# EAGLE design shield (EAGLE 7.6.0)
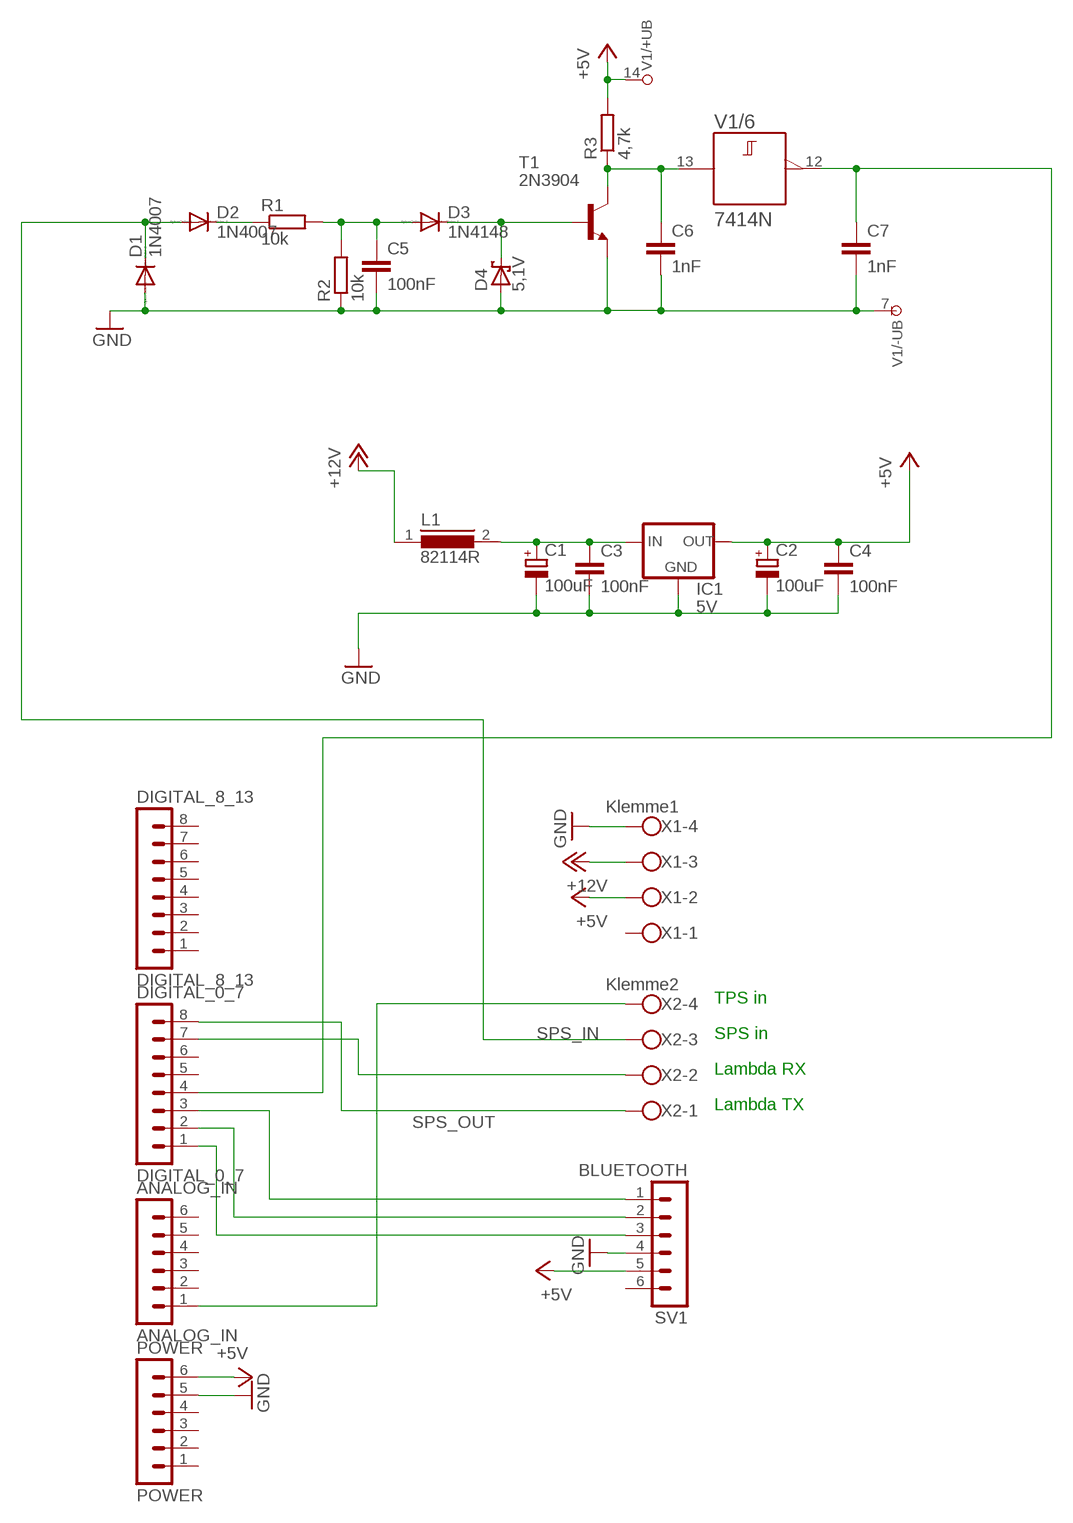
[diagram p0: schematic, sheet 1]

## Parts
ANALOG_IN  ANALOG_IN  MA06-1  [MA06-1]
C1  100uF  CPOL-EUE2-4  [E2-4]
C2  100uF  CPOL-EUE2-4  [E2-4]
C3  100nF  C-EU050-035X075  [C050-035X075]
C4  100nF  C-EU050-035X075  [C050-035X075]
C5  100nF  C-EU075-032X103  [C075-032X103]
C6  1nF  C-EU075-032X103  [C075-032X103]
C7  1nF  C-EU075-032X103  [C075-032X103]
D1  1N4007  DIODE-D-5  [D-5]
D2  1N4007  DIODE-D-5  [D-5]
D3  1N4148  DIODE-D-5  [D-5]
D4  5,1V  SCHOTTKY-DIODEDO35-7  [DO35-7]
DIGITAL_0_7  DIGITAL_0_7  MA08-1  [MA08-1]
DIGITAL_8_13  DIGITAL_8_13  MA08-1  [MA08-1]
IC1  5V  78XXS  [78XXS]
L1  82114R  [82114R]
POWER  POWER  MA06-1  [MA06-1]
R1  10k  R-EU_0204/5  [0204/5]
R2  10k  R-EU_0204/5  [0204/5]
R3  4,7k  R-EU_0204/5  [0204/5]
SV1  BLUETOOTH  MA06-1  [MA06-1]
T1  2N3904  [TO92]
V1  7414N  [DIL14]
X1  Klemme1  W237-4  [W237-4]
X2  Klemme2  W237-4  [W237-4]

## Nets
+5V: C2.+ C4.1 IC1.OUT POWER.6 R3.2 SV1.5 V1.14(/+UB:+UB) X1.2
+12V: L1.1 X1.3
GND: C1.- C2.- C3.2 C4.2 C5.2 C6.2 C7.2 D1.A D4.A IC1.GND POWER.5 R2.1 SV1.4 T1.3(E) V1.7(/-UB:-UB) X1.4
N$1: C1.+ C3.1 IC1.IN L1.2
N$2: DIGITAL_0_7.7 X2.2
N$3: DIGITAL_0_7.8 X2.1
N$4: D2.C R1.1
N$5: C5.1 D3.A R1.2 R2.2
N$6: D3.C D4.C T1.2(B)
N$7: C6.1 R3.1 T1.1(C) V1.13(/6:A)
N$8: ANALOG_IN.1 X2.4
N$9: DIGITAL_0_7.2 SV1.2
N$10: DIGITAL_0_7.1 SV1.3
N$11: DIGITAL_0_7.3 SV1.1
SPS_IN: D1.C D2.A X2.3
SPS_OUT: C7.1 DIGITAL_0_7.4 V1.12(/6:Y)
Unconnected: ANALOG_IN.2 ANALOG_IN.3 ANALOG_IN.4 ANALOG_IN.5 ANALOG_IN.6 DIGITAL_0_7.5 DIGITAL_0_7.6 DIGITAL_8_13.1 DIGITAL_8_13.2 DIGITAL_8_13.3 DIGITAL_8_13.4 DIGITAL_8_13.5 DIGITAL_8_13.6 DIGITAL_8_13.7 DIGITAL_8_13.8 POWER.1 POWER.2 POWER.3 POWER.4 SV1.6 V1.1(/1:A) V1.2(/1:Y) V1.3(/2:A) V1.4(/2:Y) V1.5(/3:A) V1.6(/3:Y) V1.8(/4:Y) V1.9(/4:A) V1.10(/5:Y) V1.11(/5:A) X1.1

## Notes on the sheet
- TPS in
- SPS in
- Lambda RX
- Lambda TX

## Library data of the parts
ANALOG_IN POWER SV1 = con-lstb:MA06-1: PIN HEADER; OC_FARNELL: unknown; OC_NEWARK: unknown
C1 C2 = rcl:CPOL-EU: POLARIZED CAPACITOR, European symbol
C3-C7 = rcl:C-EU: CAPACITOR, European symbol
D1-D3 = diode:DIODE-: DIODE
D4 = diode:SCHOTTKY-DIODE: Schottky Diode
DIGITAL_0_7 DIGITAL_8_13 = con-lstb:MA08-1: PIN HEADER; OC_FARNELL: unknown; OC_NEWARK: unknown
IC1 = v-reg:78XXS: VOLTAGE REGULATOR
L1 = inductors:82114R: INDUCTOR
R1-R3 = rcl:R-EU_: RESISTOR, European symbol
T1 = transistor:2N3904: NPN TRANSISTOR
V1 = 74ttl-din:74*14: Hex schmitt trigger INVERTER
X1 X2 = con-wago-500:W237-4: WAGO SCREW CLAMP; OC_FARNELL: unknown; OC_NEWARK: unknown

## Board
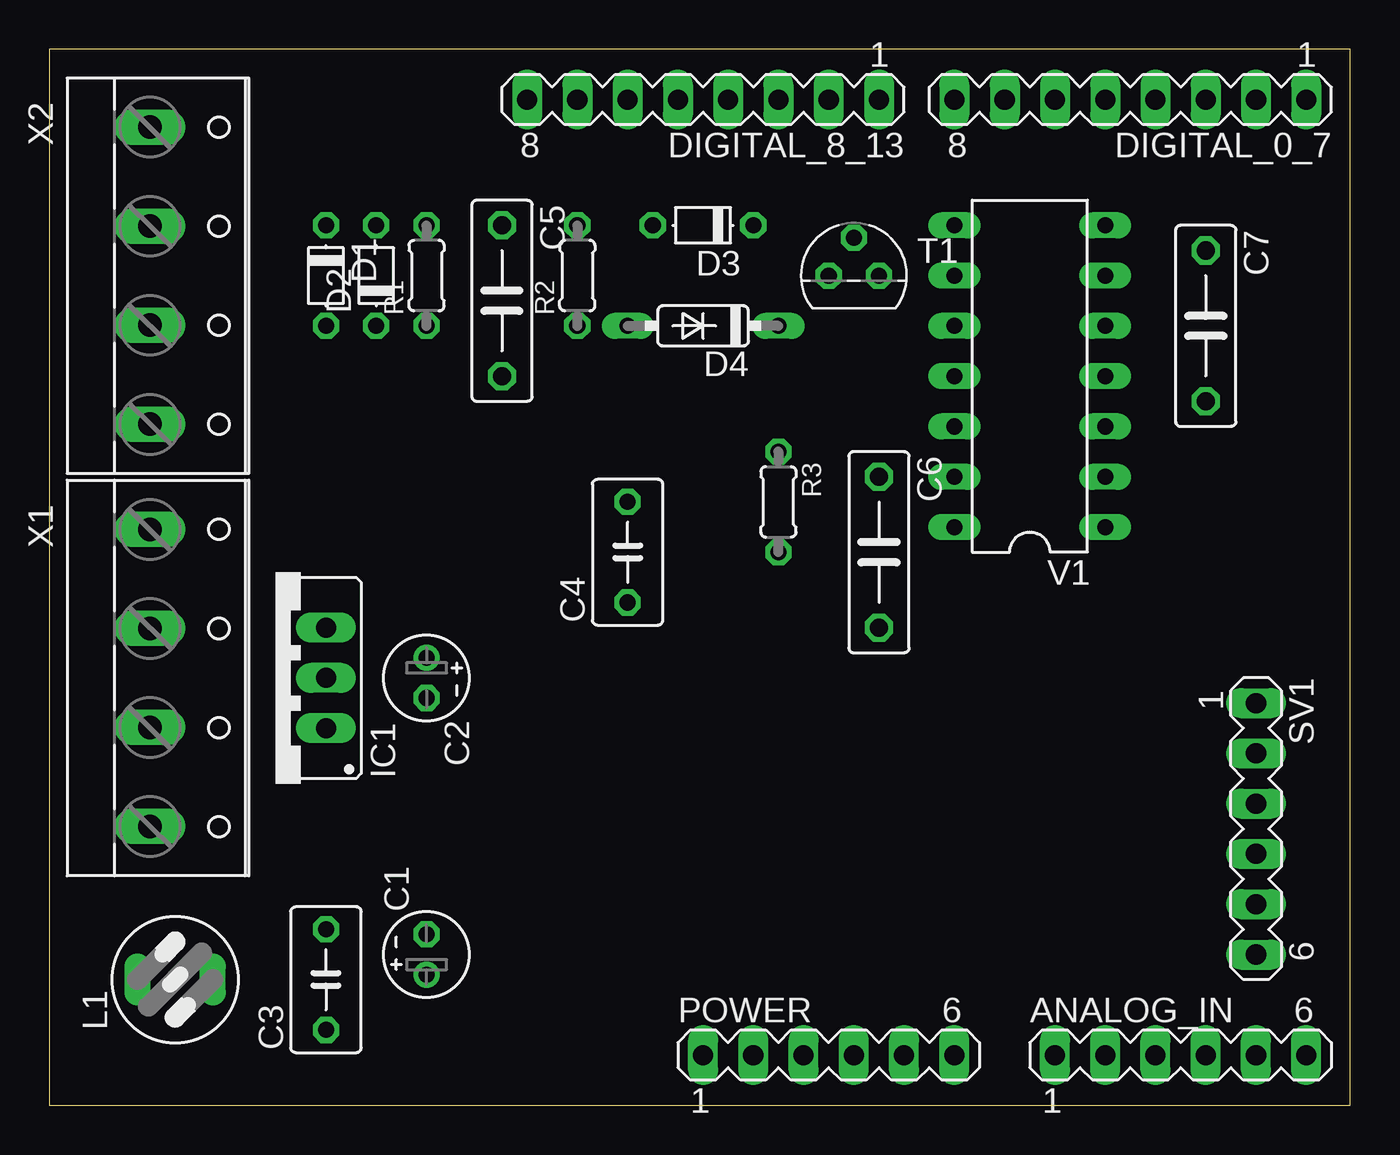
[diagram p1: board, top side]
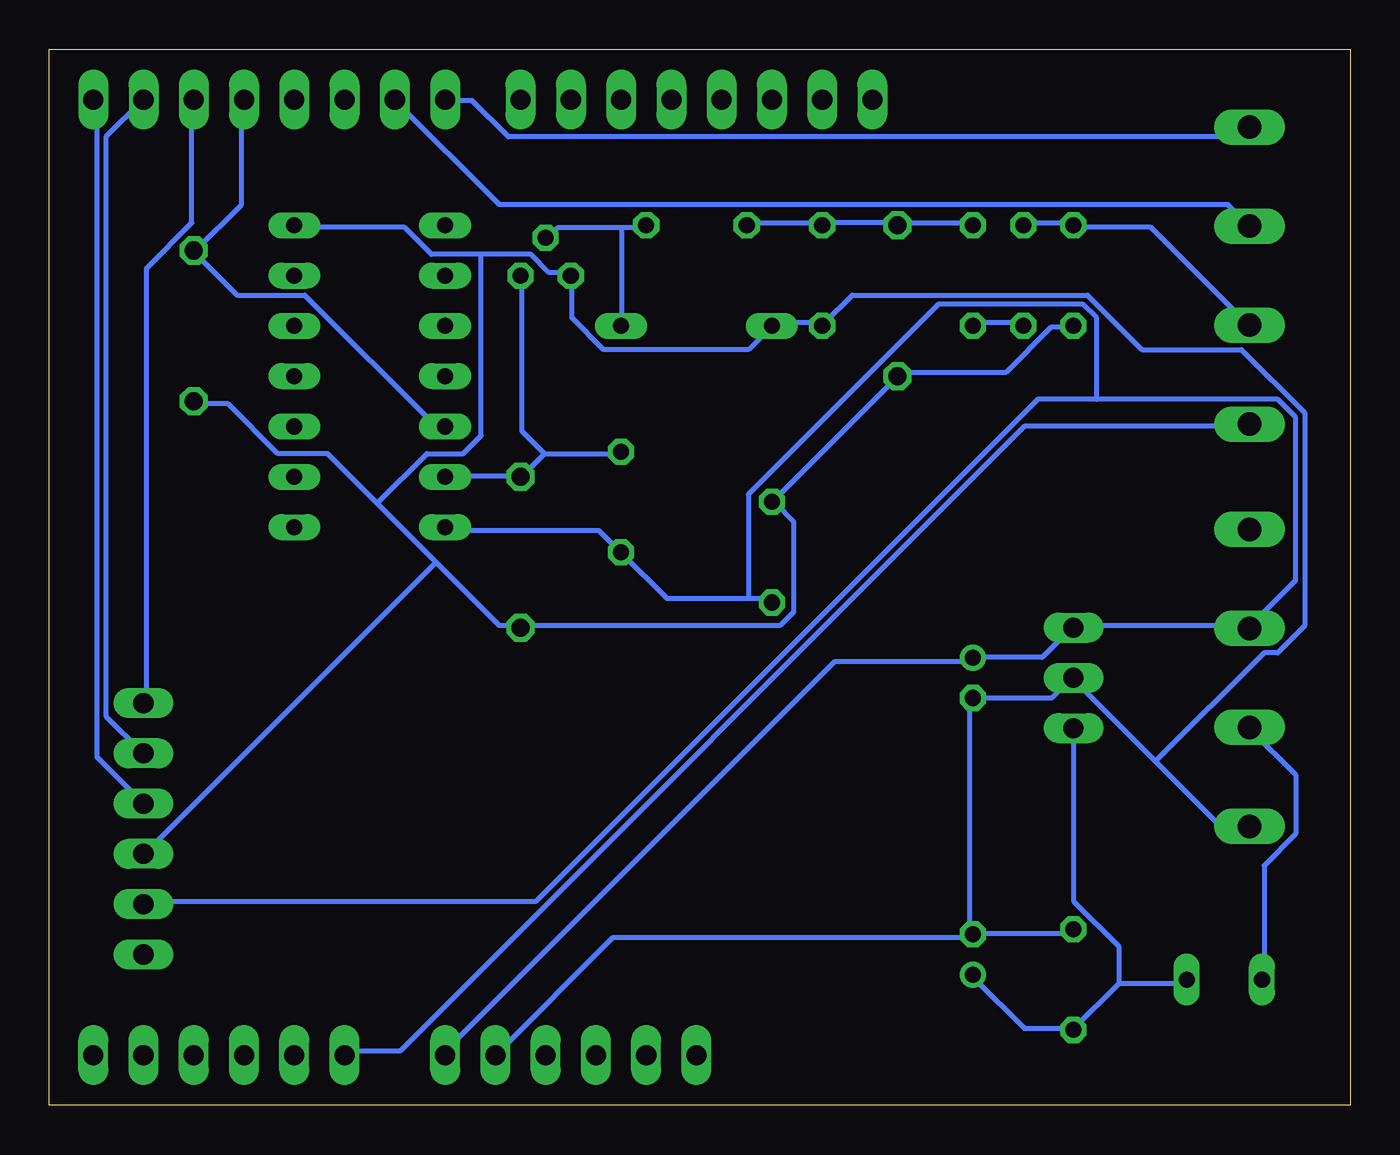
[diagram p2: board, bottom side, seen from below]

Size 65.71 x 53.33 mm. Coordinates in mm from the lower left corner, seen from the top.
Outline: 0,0 65.71,0 65.71,53.33 0,53.33 0,0
Copper layers (1*16): Top 0.035mm / dielectric 1.5mm / Bottom 0.035mm
Design rules "default": minimum track width 10mil, minimum drill 24mil, track to track 8mil, track to pad 8mil, pad to pad 8mil, via to via 8mil, smd to smd 8mil, copper to edge 40mil, drill to drill 8mil, minimum pad ring 10mil, minimum via ring 8mil, stop-mask expansion 4mil, vias tented up to drill 0mil, thermal gap 10mil

### Footprints (pad centres in the part's own frame; a part is rotated, then mirrored left to right if it is on the bottom)
MA06-1 = drill 1.016 long: 1 -6.35,0; 2 -3.81,0; 3 -1.27,0; 4 1.27,0; 5 3.81,0; 6 6.35,0
E2-4 = drill 0.813 pad 1.27: + -1.016,0 | drill 0.813 pad 1.27 octagon: - 1.016,0
C050-035X075 = drill 0.813 octagon: 1 -2.54,0; 2 2.54,0
C075-032X103 = drill 0.914 octagon: 1 -3.81,0; 2 3.81,0
D-5 = drill 0.813 octagon: A 2.54,0; C -2.54,0
DO35-7 = drill 0.813 long: A 3.81,0; C -3.81,0
MA08-1 = drill 1.016 long: 1 -8.89,0; 2 -6.35,0; 3 -3.81,0; 4 -1.27,0; 5 1.27,0; 6 3.81,0; 7 6.35,0; 8 8.89,0
78XXS = drill 1.016 long: GND 0,-2.54; IN -2.54,-2.54; OUT 2.54,-2.54
82114R = drill 0.813 long: 1 0,1.905; 2 0,-1.905
0204/5 = drill 0.813 octagon: 1 -2.54,0; 2 2.54,0
TO92 = drill 0.813 octagon: 1 1.27,0; 2 0,1.905; 3 -1.27,0
DIL14 = drill 0.813 long: 1 -7.62,-3.81; 2 -5.08,-3.81; 3 -2.54,-3.81; 4 0,-3.81; 5 2.54,-3.81; 6 5.08,-3.81; 7 7.62,-3.81; 8 7.62,3.81; 9 5.08,3.81; 10 2.54,3.81; 11 0,3.81; 12 -2.54,3.81; 13 -5.08,3.81; 14 -7.62,3.81
W237-4 = drill 1.194 long: 1 -7.5,-1.27; 2 -2.5,-1.27; 3 2.5,-1.27; 4 7.5,-1.27

### Placement (x,y rotation side)
ANALOG_IN  57.15,2.54 0 top
C1  19.05,7.62 90 top
C2  19.05,21.59 270 top
C3  13.97,6.35 90 top
C4  29.21,27.94 90 top
C5  22.86,40.64 270 top
C6  41.91,27.94 270 top
C7  58.42,39.37 270 top
D1  13.97,41.91 270 top
D2  16.51,41.91 90 top
D3  33.02,44.45 180 top
D4  33.02,39.37 180 top
DIGITAL_0_7  54.61,50.8 180 top
DIGITAL_8_13  33.02,50.8 180 top
IC1  11.43,21.59 90 top
L1  6.35,6.35 90 top
POWER  39.37,2.54 0 top
R1  19.05,41.91 90 top
R2  26.67,41.91 90 top
R3  36.83,30.48 270 top
SV1  60.96,13.97 270 top
T1  40.64,41.91 0 top
V1  49.53,36.83 90 top
X1  6.35,21.59 270 top
X2  6.35,41.91 270 top

### Tracks (layer width: path | path; a pad name or v marks a point on that pad's centre or on a via)
+5V
  Bottom 0.254: POWER.6 45.72,2.74 26.06,22.4 19.2,22.4 C2.+ 18.97,22.63 15.54,22.63 14.17,24 IC1.OUT 13.95,24.23 5.26,24.23 X1.2 5.03,24.23 2.74,26.52 2.74,34.75 3.66,35.66 12.8,35.66 | 30.4,25.6 34.52,25.6 36.8,27.89 R3.2 37.03,28.12 37.95,29.03 45.72,29.03 V1.14 | 30.4,25.6 29.26,25.6 C4.1 | 12.8,35.66 15.77,35.66 41.15,10.29 60.81,10.29 SV1.5 | 30.4,25.6 30.4,30.86 20.8,40.46 13.49,40.46 12.8,39.78 12.8,35.66
+12V
  Bottom 0.254: L1.1 4.34,6.4 4.34,12.12 2.74,13.72 2.74,16.69 5.03,18.97 X1.3
GND
  Bottom 0.254: 9.83,17.37 13.95,21.49 IC1.GND 14.17,21.49 15.09,20.57 C2.- 19.2,20.57 19.2,8.69 C1.- | 9.83,17.37 6.63,14.17 5.26,14.17 X1.4 | C3.2 14.17,8.69 18.97,8.69 C1.- | POWER.5 37.26,8.46 19.2,8.46 C1.- | 43.89,42.98 41.38,42.98 40.46,42.06 39.55,42.06 T1.3 39.32,41.83 39.32,39.78 37.72,38.18 30.4,38.18 D4.A 29.03,39.55 26.75,39.55 R2.1 26.52,39.55 25.15,40.92 13.26,40.92 10.52,38.18 5.49,38.18 2.29,34.98 2.29,24.23 3.66,22.86 4.34,22.86 9.83,17.37 | 43.89,42.98 46.41,42.98 47.78,44.35 53.26,44.35 V1.7 | D1.A 14.17,39.32 15.09,39.32 17.37,37.03 22.86,37.03 C5.2 22.86,36.8 29.03,30.63 C4.2 29.03,30.4 28.12,29.49 28.12,24.92 28.8,24.23 41.83,24.23 C6.2 42.06,24.23 42.98,24.23 46.18,27.43 | 46.18,27.43 49.15,30.4 | 49.15,30.4 51.66,32.92 54.18,32.92 56.69,35.43 58.29,35.43 C7.2 | 46.18,27.43 60.81,12.8 SV1.4 | 43.89,42.98 43.89,33.83 44.81,32.92 46.63,32.92 49.15,30.4
N$1
  Bottom 0.254: C1.+ 18.97,6.4 16.46,3.89 14.17,3.89 C3.1 13.95,3.89 11.66,6.17 | 11.66,6.17 8.46,6.17 L1.2 | 11.66,6.17 11.66,8 13.95,10.29 13.95,18.97 IC1.IN
N$2
  Bottom 0.254: DIGITAL_0_7.7 48.23,50.75 42.98,45.49 6.17,45.49 5.26,44.58 X2.2
N$3
  Bottom 0.254: DIGITAL_0_7.8 45.72,50.75 44.35,50.75 42.52,48.92 5.71,48.92 5.26,49.38 X2.1
N$4
  Bottom 0.254: D2.C 16.69,39.55 18.97,39.55 R1.1
N$5
  Bottom 0.254: D3.A 30.4,44.58 26.75,44.58 R2.2 26.52,44.58 22.86,44.58 | 22.86,44.58 19.2,44.58 R1.2 | 22.86,44.58 C5.1
N$6
  Bottom 0.254: 36.8,44.35 40.01,44.35 40.46,43.89 T1.2 | 36.8,44.35 35.66,44.35 D3.C | 36.8,44.35 36.8,39.55 D4.C
N$7
  Bottom 0.254: V1.13 45.72,31.77 42.06,31.77 C6.1 41.83,31.77 40.69,32.92 | 40.69,32.92 37.03,32.92 R3.1 | 40.69,32.92 41.83,34.06 41.83,41.83 T1.1
N$8
  Bottom 0.254: ANALOG_IN.1 50.75,2.74 48.01,2.74 16.46,34.29 5.26,34.29 X2.4
N$9
  Bottom 0.254: SV1.2 61.04,17.83 62.87,19.66 62.87,48.92 61.04,50.75 DIGITAL_0_7.2
N$10
  Bottom 0.254: SV1.3 63.32,17.6 63.32,50.75 DIGITAL_0_7.1
N$11
  Bottom 0.254: DIGITAL_0_7.3 58.52,50.75 58.52,44.58 60.81,42.29 60.81,20.34 SV1.1
SPS_IN
  Bottom 0.254: D2.A 16.46,44.58 14.17,44.58 D1.C 13.95,44.35 10.06,44.35 5.26,39.55 X2.3
SPS_OUT
  Bottom 0.254: V1.12 46.18,34.29 52.81,40.92 56.24,40.92 58.29,42.98 C7.1 58.29,43.2 56.01,45.49 56.01,50.75 DIGITAL_0_7.4